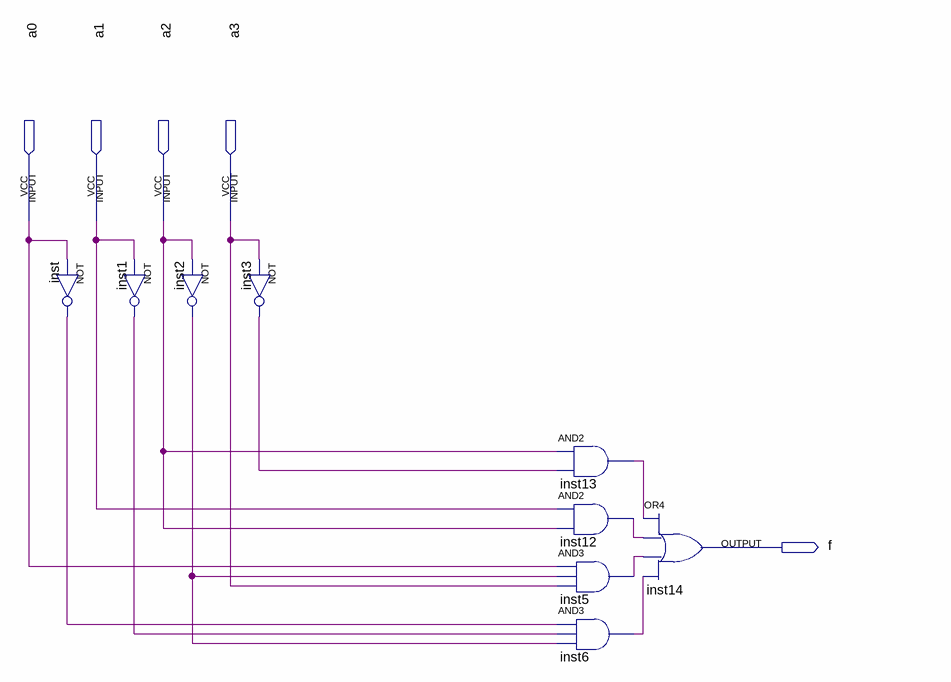
[diagram p0: schematic sheet]
// Quartus schematic F.bdf as structural Verilog: 9 symbols, 5 pins
module F (
  input  a0,
  input  a1,
  input  a2,
  input  a3,
  output f
);

  wire inst1_out, inst2_out, inst3_out, inst5_out, inst6_out, inst12_out, inst13_out, inst_out;

  not inst (inst_out, a0);
  not inst1 (inst1_out, a1);
  not inst2 (inst2_out, a2);
  not inst3 (inst3_out, a3);
  and inst13 (inst13_out, a2, inst3_out);
  and inst12 (inst12_out, a1, a2);
  and inst5 (inst5_out, a0, inst2_out, a3);
  and inst6 (inst6_out, inst_out, inst1_out, inst2_out);
  or inst14 (f, inst13_out, inst12_out, inst5_out, inst6_out);
endmodule
